# EAGLE schematic antarctic penetrator avionics hw1 (EAGLE 7.5.0)
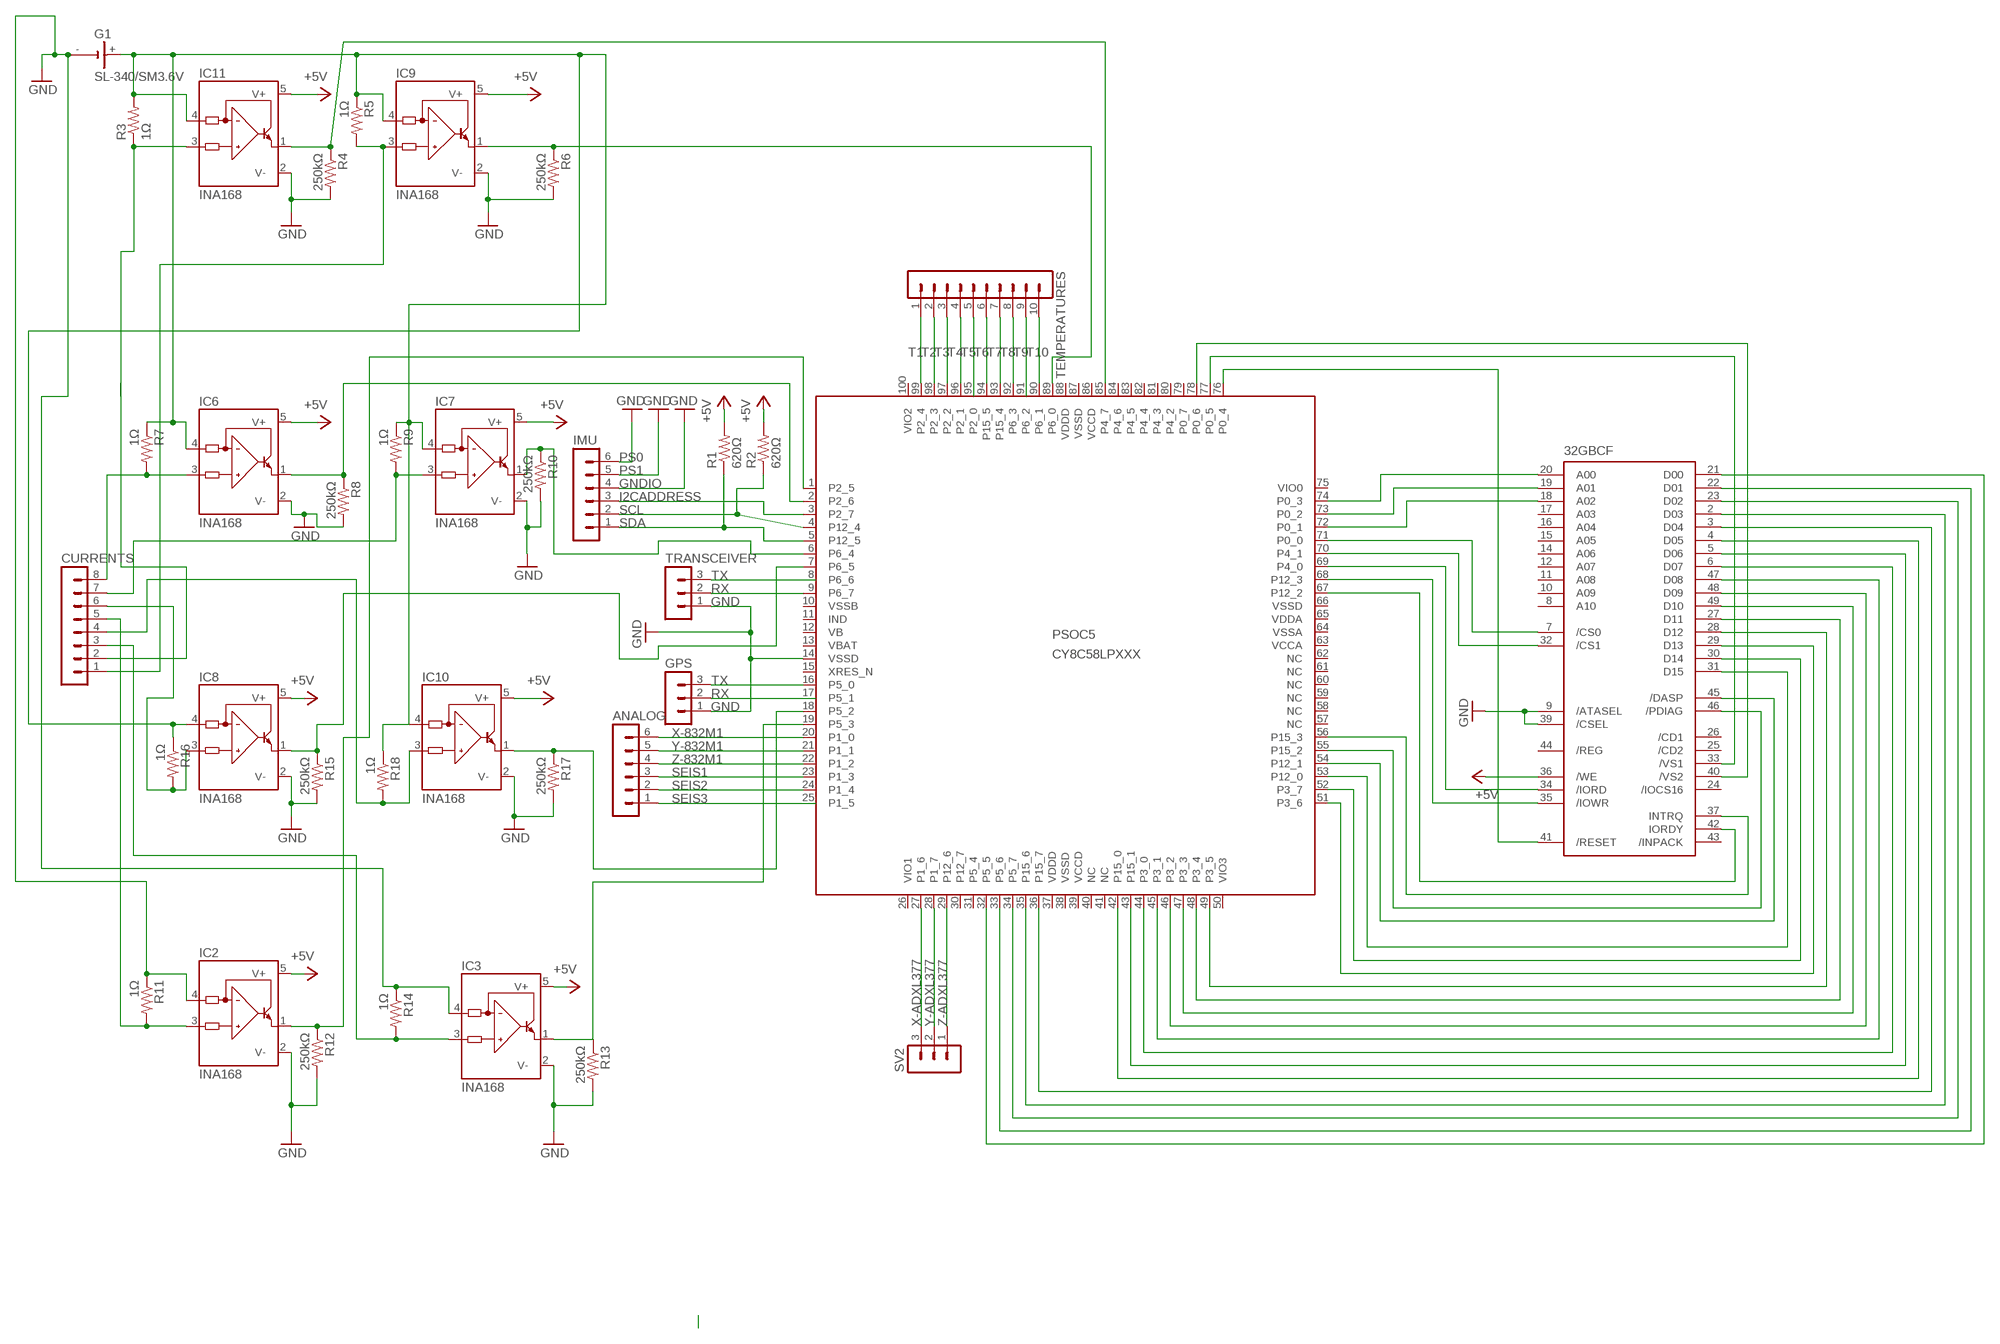
[diagram p0: schematic, sheet 1]

## Parts
32GBCF  CF-CARD-IDE_MODE  [MI20-50PD-SF]
ANALOG  MA06-1  [MA06-1]
CURRENTS  MA08-1  [MA08-1]
G1  SL-340/SM3.6V  [SL-340/SM3.6V]
GPS  MA03-1  [MA03-1]
IC2  INA168  [SOT23-5]
IC3  INA168  [SOT23-5]
IC6  INA168  [SOT23-5]
IC7  INA168  [SOT23-5]
IC8  INA168  [SOT23-5]
IC9  INA168  [SOT23-5]
IC10  INA168  [SOT23-5]
IC11  INA168  [SOT23-5]
IMU  MA06-1  [MA06-1]
PSOC5  CY8C58LPXXX  [TQFP100-14X14]
R1  620Ω  R-US_0204/5  [0204/5]
R2  620Ω  R-US_0204/5  [0204/5]
R3  1Ω  R-US_0204/5  [0204/5]
R4  250kΩ  R-US_0204/5  [0204/5]
R5  1Ω  R-US_0204/5  [0204/5]
R6  250kΩ  R-US_0204/5  [0204/5]
R7  1Ω  R-US_0204/5  [0204/5]
R8  250kΩ  R-US_0204/5  [0204/5]
R9  1Ω  R-US_0204/5  [0204/5]
R10  250kΩ  R-US_0204/5  [0204/5]
R11  1Ω  R-US_0204/5  [0204/5]
R12  250kΩ  R-US_0204/5  [0204/5]
R13  250kΩ  R-US_0204/5  [0204/5]
R14  1Ω  R-US_0204/5  [0204/5]
R15  250kΩ  R-US_0204/5  [0204/5]
R16  1Ω  R-US_0204/5  [0204/5]
R17  250kΩ  R-US_0204/5  [0204/5]
R18  1Ω  R-US_0204/5  [0204/5]
SV2  MA03-1  [MA03-1]
TEMPERATURES  MA10-1  [MA10-1]
TRANSCEIVER  MA03-1  [MA03-1]

## Nets
+5V: 32GBCF.36(/WE) IC2.5(V+) IC3.5(V+) IC6.5(V+) IC7.5(V+) IC8.5(V+) IC9.5(V+) IC10.5(V+) IC11.5(V+) R1.2 R2.2
GND: 32GBCF.9(/ATASEL) 32GBCF.39(/CSEL) G1.- GPS.1 IC2.2(V-) IC2.4(IN-) IC3.2(V-) IC3.4(IN-) IC6.2(V-) IC7.2(V-) IC8.2(V-) IC9.2(V-) IC10.2(V-) IC11.2(V-) PSOC5.14(VSSD) R4.2 R6.2 R8.2 R10.2 R11.1 R12.2 R13.2 R14.1 R15.2 R17.2 TRANSCEIVER.1
GNDIO: IMU.4 ; supply symbol labelled GND
I2CADDRESS: IMU.3 PSOC5.3(P2_7)
N$1: IC9.1(OUT) PSOC5.89(P6_0) R6.1
N$3: IC11.1(OUT) PSOC5.85(P4_7) R4.1
N$4: 32GBCF.41(/RESET) PSOC5.76(P0_4)
N$5: CURRENTS.6 IC8.3(IN+) R16.2
N$6: CURRENTS.7 IC7.3(IN+) R9.2
N$7: CURRENTS.8 IC6.3(IN+) R7.2
N$8: CURRENTS.5 IC2.3(IN+) R11.2
N$9: CURRENTS.4 IC10.3(IN+) R18.2
N$10: CURRENTS.3 IC3.3(IN+) R14.2
N$11: CURRENTS.2 IC11.3(IN+) R3.1
N$12: 32GBCF.33(/VS1) PSOC5.77(P0_5)
N$13: IC9.3(IN+) R5.2
N$14: 32GBCF.40(/VS2) PSOC5.78(P0_6)
N$15: IC10.1(OUT) PSOC5.18(P5_2) R17.1
N$16: IC3.1(OUT) PSOC5.19(P5_3)
N$17: IC7.1(OUT) PSOC5.6(P6_4) R10.1
N$18: IC6.1(OUT) PSOC5.2(P2_6) R8.1
N$19: IC8.1(OUT) PSOC5.7(P6_5) R15.1
N$20: IC2.1(OUT) PSOC5.1(P2_5) R12.1
N$21: 32GBCF.20(A00) PSOC5.74(P0_3)
N$22: 32GBCF.19(A01) PSOC5.73(P0_2)
N$23: 32GBCF.18(A02) PSOC5.72(P0_1)
N$24: 32GBCF.7(/CS0) PSOC5.71(P0_0)
N$25: 32GBCF.32(/CS1) PSOC5.70(P4_1)
N$26: 32GBCF.34(/IORD) PSOC5.69(P4_0)
N$27: 32GBCF.35(/IOWR) PSOC5.68(P12_3)
N$28: 32GBCF.42(IORDY) PSOC5.67(P12_2)
N$29: 32GBCF.37(INTRQ) PSOC5.56(P15_3)
N$30: 32GBCF.46(/PDIAG) PSOC5.55(P15_2)
N$31: 32GBCF.45(/DASP) PSOC5.54(P12_1)
N$32: 32GBCF.31(D15) PSOC5.53(P12_0)
N$33: 32GBCF.30(D14) PSOC5.52(P3_7)
N$34: 32GBCF.29(D13) PSOC5.51(P3_6)
N$36: 32GBCF.28(D12) PSOC5.49(P3_5)
N$37: 32GBCF.27(D11) PSOC5.48(P3_4)
N$38: 32GBCF.49(D10) PSOC5.47(P3_3)
N$39: 32GBCF.48(D09) PSOC5.46(P3_2)
N$40: 32GBCF.47(D08) PSOC5.45(P3_1)
N$41: 32GBCF.6(D07) PSOC5.44(P3_0)
N$42: 32GBCF.5(D06) PSOC5.43(P15_1)
N$43: 32GBCF.4(D05) PSOC5.42(P15_0)
N$44: 32GBCF.3(D04) PSOC5.36(P15_7)
N$45: 32GBCF.2(D03) PSOC5.35(P15_6)
N$46: 32GBCF.23(D02) PSOC5.34(P5_7)
N$47: 32GBCF.22(D01) PSOC5.33(P5_6)
N$49: 32GBCF.21(D00) PSOC5.32(P5_5)
N$53: G1.+ IC6.4(IN-) IC7.4(IN-) IC8.4(IN-) IC9.4(IN-) IC10.4(IN-) IC11.4(IN-) R3.2 R5.1 R7.1 R9.1 R16.1 R18.1
PS0: IMU.6 ; supply symbol labelled GND
PS1: IMU.5 ; supply symbol labelled GND
RX: GPS.2 PSOC5.9(P6_7) TRANSCEIVER.2
SCL: IMU.2 PSOC5.4(P12_4) R2.1
SDA: IMU.1 PSOC5.5(P12_5) R1.1
SEIS1: ANALOG.3 PSOC5.23(P1_3)
SEIS2: ANALOG.2 PSOC5.24(P1_4)
SEIS3: ANALOG.1
T1: PSOC5.99(P2_4) TEMPERATURES.1
T2: PSOC5.98(P2_3) TEMPERATURES.2
T3: PSOC5.97(P2_2) TEMPERATURES.3
T4: PSOC5.96(P2_1) TEMPERATURES.4
T5: TEMPERATURES.5
T6: PSOC5.94(P15_5) TEMPERATURES.6
T7: PSOC5.93(P15_4) TEMPERATURES.7
T8: PSOC5.92(P6_3) TEMPERATURES.8
T9: TEMPERATURES.9
T10: PSOC5.90(P6_1) TEMPERATURES.10
TX: GPS.3 PSOC5.16(P5_0) TRANSCEIVER.3
X-832M1: ANALOG.6 PSOC5.20(P1_0)
X-ADXL377: PSOC5.27(P1_6) SV2.3
Y-832M1: ANALOG.5 PSOC5.21(P1_1)
Y-ADXL377: PSOC5.28(P1_7) SV2.2
Z-832M1: ANALOG.4 PSOC5.22(P1_2)
Z-ADXL377: PSOC5.29(P12_6) SV2.1
Unconnected: 32GBCF.8(A10) 32GBCF.10(A09) 32GBCF.11(A08) 32GBCF.12(A07) 32GBCF.14(A06) 32GBCF.15(A05) 32GBCF.16(A04) 32GBCF.17(A03) 32GBCF.24(/IOCS16) 32GBCF.25(/CD2) 32GBCF.26(/CD1) 32GBCF.43(/INPACK) 32GBCF.44(/REG) CURRENTS.1 G1.-@1(-) PSOC5.8(P6_6) PSOC5.11(IND) PSOC5.12(VB) PSOC5.13(VBAT) PSOC5.15(XRES_N) PSOC5.17(P5_1) PSOC5.25(P1_5) PSOC5.26(VIO1) PSOC5.30(P12_7) PSOC5.31(P5_4) PSOC5.40(NC) PSOC5.41(NC) PSOC5.50(VIO3) PSOC5.57(NC) PSOC5.58(NC) PSOC5.59(NC) PSOC5.60(NC) PSOC5.61(NC) PSOC5.62(NC) PSOC5.75(VIO0) PSOC5.79(P0_7) PSOC5.80(P4_2) PSOC5.81(P4_3) PSOC5.82(P4_4) PSOC5.83(P4_5) PSOC5.84(P4_6) PSOC5.91(P6_2) PSOC5.95(P2_0) PSOC5.100(VIO2) R13.1

## Power pins joined to a net without a drawn wire
GND1: 32GBCF.1(GND1)
GND2: 32GBCF.50(GND2)
VCC1: 32GBCF.38(VCC1)
VCC2: 32GBCF.13(VCC2)
VCCA: PSOC5.63(VCCA)
VCCD: PSOC5.39(VCCD) PSOC5.86(VCCD)
VDDA: PSOC5.65(VDDA)
VDDD: PSOC5.37(VDDD) PSOC5.88(VDDD)
VSSA: PSOC5.64(VSSA)
VSSB: PSOC5.10(VSSB)
VSSD: PSOC5.38(VSSD) PSOC5.66(VSSD) PSOC5.87(VSSD)

## Library data of the parts
32GBCF = con-hirose:CF-CARD-IDE_MODE: Compact Flash Adapter Type I or II without Eject Button Source: con-hirose.lbr from Bob Starr <rtzaudio@mindspring.com>; OC_FARNELL: unknown; OC_NEWARK: unknown
ANALOG IMU = con-lstb:MA06-1: PIN HEADER; OC_FARNELL: unknown; OC_NEWARK: unknown
CURRENTS = con-lstb:MA08-1: PIN HEADER; OC_FARNELL: unknown; OC_NEWARK: unknown
G1 = battery:SL-340/SM3.6V: LI BATTERY Sonnenschein
GPS SV2 TRANSCEIVER = con-lstb:MA03-1: PIN HEADER; OC_FARNELL: unknown; OC_NEWARK: unknown
IC2 IC3 IC6-IC11 = burr-brown:INA168: High-Side Measurement Current Shunt Monitor; MF: TEXAS INSTRUMENTS; MPN: INA168NA/250; OC_FARNELL: 4375737; OC_NEWARK: 35C1744
PSOC5 = cypress:CY8C58LPXXX: CY8C58LPXXX_TQFP100_4JTAG edit this description Auto generated by make-symbol-device-package-bsdl.ulp Rev. 43 Source: CY8C58LPXXX_TQFP100_4JTAG.bsdl
R1-R18 = rcl:R-US_: RESISTOR, American symbol
TEMPERATURES = con-lstb:MA10-1: PIN HEADER; OC_FARNELL: unknown; OC_NEWARK: unknown

## Module CY8C58LP
Ports: 1(io) 2(io) 3(io)

### Library data of the parts